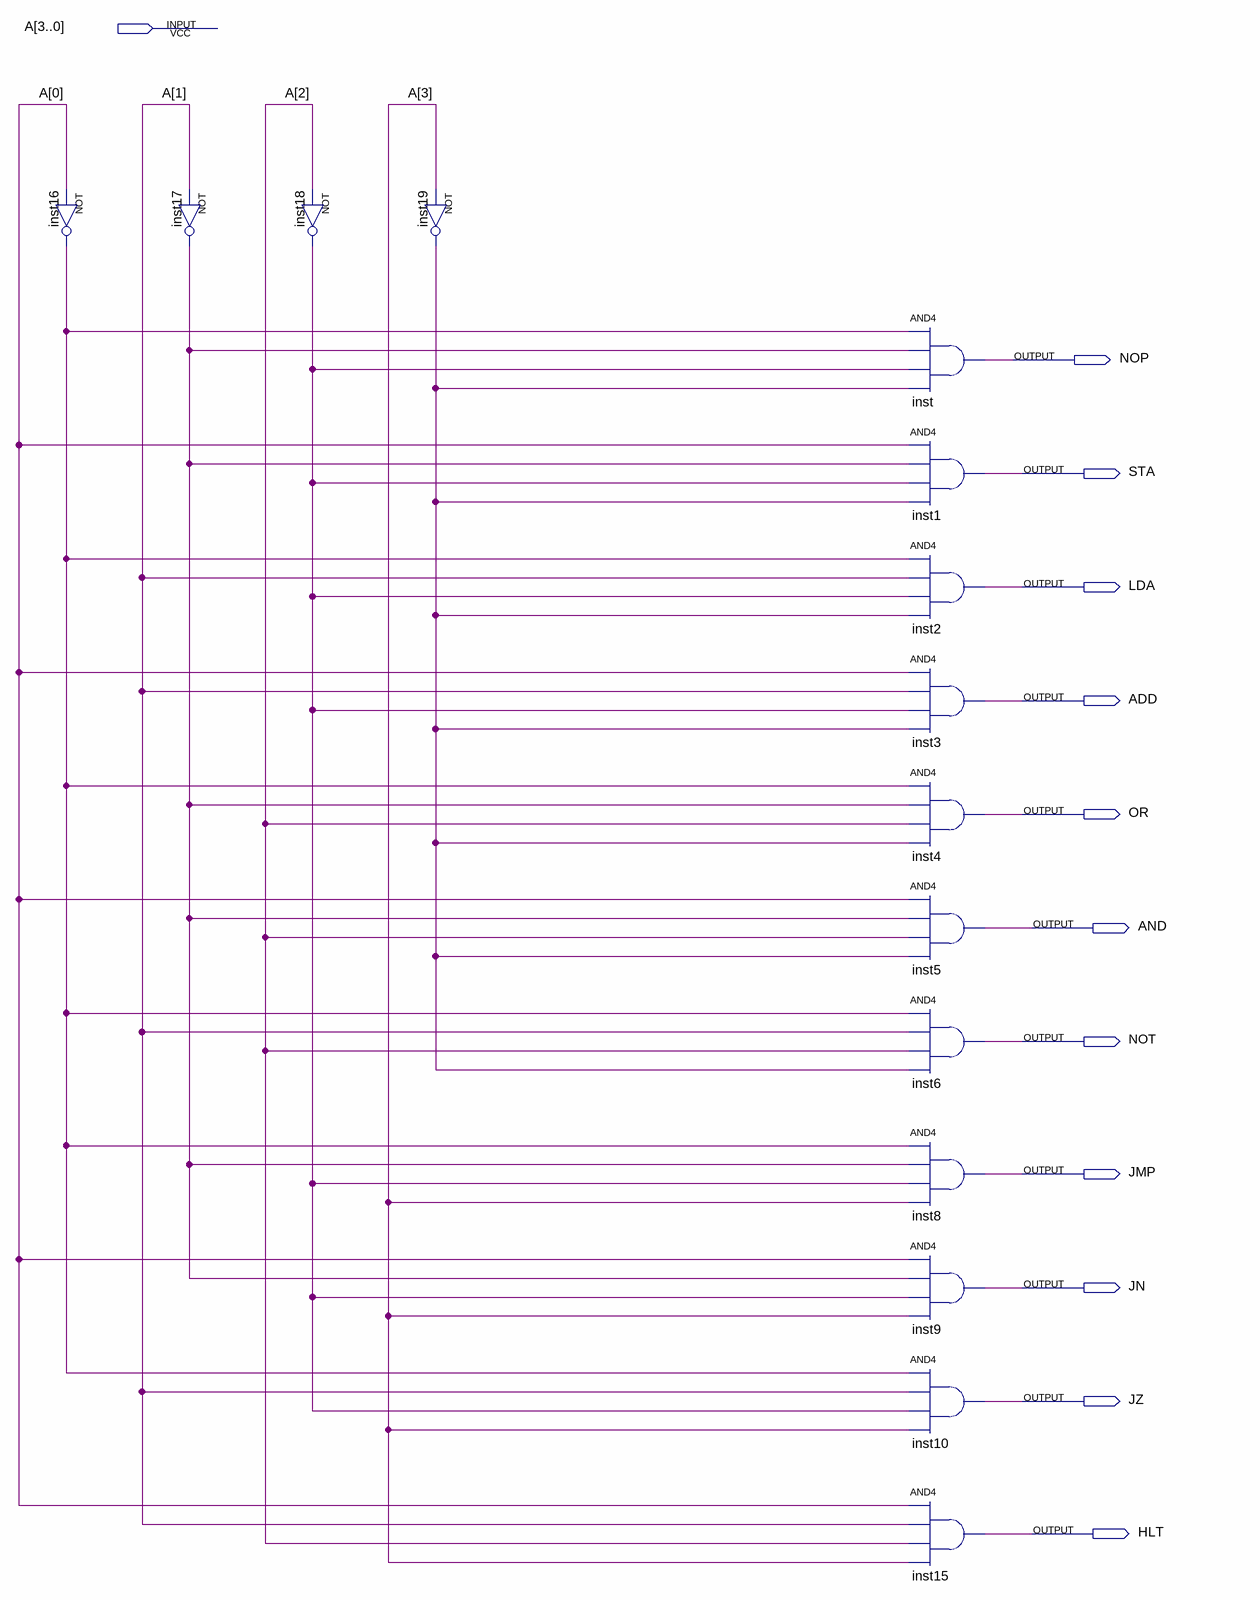
[diagram p0: schematic sheet]
// Quartus schematic DECOD_OP.bdf as structural Verilog: 15 symbols, 12 pins
module DECOD_OP (
  input  [3:0] A,
  output NOP,
  output STA,
  output LDA,
  output ADD,
  output OR,
  output AND,
  output NOT,
  output JMP,
  output JN,
  output JZ,
  output HLT
);

  wire inst16_out, inst17_out, inst18_out, inst19_out;

  not inst16 (inst16_out, A[0]);
  not inst17 (inst17_out, A[1]);
  not inst18 (inst18_out, A[2]);
  not inst19 (inst19_out, A[3]);
  and inst (NOP, inst16_out, inst17_out, inst18_out, inst19_out);
  and inst1 (STA, A[0], inst17_out, inst18_out, inst19_out);
  and inst2 (LDA, inst16_out, A[1], inst18_out, inst19_out);
  and inst3 (ADD, A[0], A[1], inst18_out, inst19_out);
  and inst4 (OR, inst16_out, inst17_out, A[2], inst19_out);
  and inst5 (AND, A[0], inst17_out, A[2], inst19_out);
  and inst6 (NOT, inst16_out, A[1], A[2], inst19_out);
  and inst8 (JMP, inst16_out, inst17_out, inst18_out, A[3]);
  and inst9 (JN, A[0], inst17_out, inst18_out, A[3]);
  and inst10 (JZ, inst16_out, A[1], inst18_out, A[3]);
  and inst15 (HLT, A[0], A[1], A[2], A[3]);
endmodule
